# Altium schematic sheet NETWORK_RS485.SchDoc
size A4; SheetNumber: 3; SheetTotal: 6
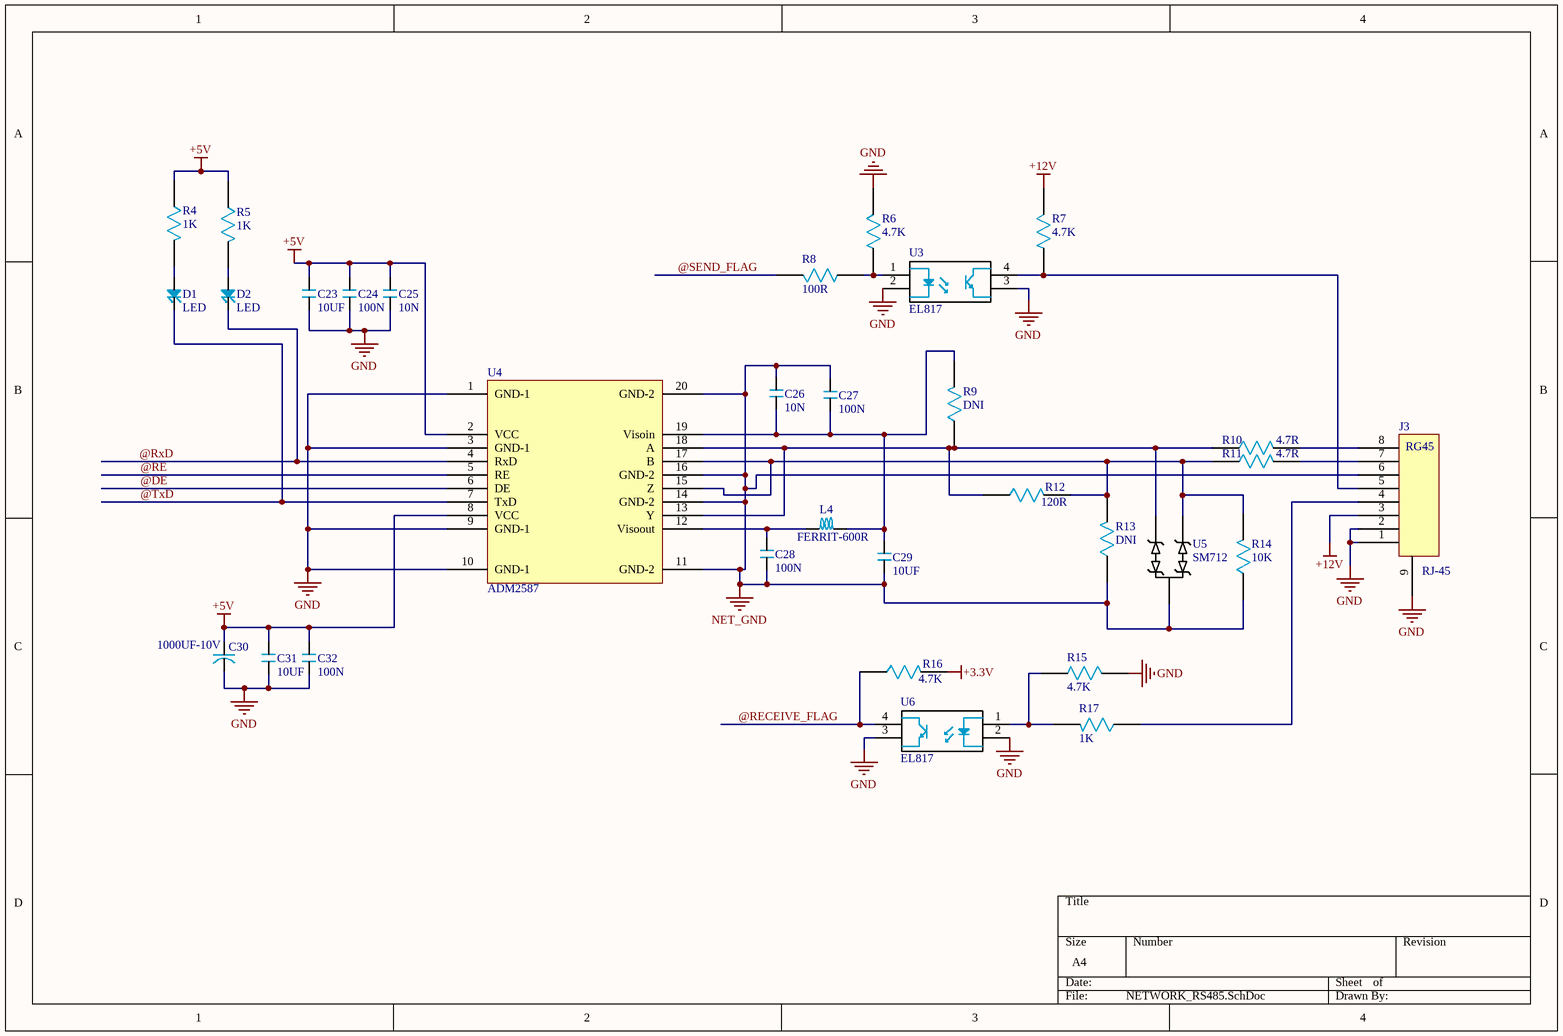
[diagram p0: NETWORK_RS485.SchDoc]

## Parts
C23  10UF  [0603]
C24  100N  [0603]
C25  10N  [0603]
C26  10N  [1206]
C27  100N  [1206]
C28  100N  [1206]
C29  10UF  [1206]
C30  1000UF-10V  [RB.2/.4]
C31  10UF  [0603]
C32  100N  [0603]
D1  LED  [0603]
D2  LED  [0603]
J3  RJ-45  [RJ-45]
L4  FERRIT-600R  [1206]
R4  1K  [0603]
R5  1K  [0603]
R6  4.7K  [1206]
R7  4.7K  [1206]
R8  100R  [1206]
R9  DNI  [1206]
R10  4.7R  [1206]
R11  4.7R  [1206]
R12  120R  [1206]
R13  DNI  [1206]
R14  10K  [1206]
R15  4.7K  [1206]
R16  4.7K  [1206]
R17  1K  [1206]
U3  EL817  [DIP4]
U4  ADM2587  [SOIC20_W]
U5  SM712  [SOT-23]
U6  EL817  [DIP4]

## Nets
+3.3V: R16.2
+5V: C23.2 C24.2 C25.1 C30.1 C31.2 C32.2 R4.1 R5.1 U4.2(VCC) U4.8(VCC)
+12V: J3.3 R7.1
GND: C23.1 C24.1 C25.2 C30.2 C31.1 C32.1 J3.1 J3.2 J3.9 R6.1 R15.1 U3.2 U3.3 U4.1(GND-1) U4.3(GND-1) U4.9(GND-1) U4.10(GND-1) U6.2 U6.3
NET_GND: C26.1 C27.2 C28.2 C29.1 J3.6 R13.1 R14.1 U4.11(GND-2) U4.14(GND-2) U4.16(GND-2) U4.20(GND-2) U5.3
@DE: U4.6(DE)
@RE: U4.5(RE)
@RECEIVE_FLAG: R16.1 U6.4
@RxD: D2.2 U4.4(RxD)
@SEND_FLAG: R8.1
@TxD: D1.2 U4.7(TxD)
NetC26_2: C26.2 C27.1 C29.2 L4.2 R9.2 U4.19(Visoin)
NetC28_1: C28.1 L4.1 U4.12(Visoout)
NetD1_1: D1.1 R4.2
NetD2_1: D2.1 R5.2
NetJ3_4: J3.4 R17.1
NetJ3_5: J3.5 R7.2 U3.4
NetJ3_7: J3.7 R11.2
NetJ3_8: J3.8 R10.2
NetR6_2: R6.2 R8.2 U3.1
NetR9_1: R9.1 R10.1 R12.1 U4.13(Y) U4.18(A) U5.1
NetR11_1: R11.1 R12.2 R13.2 R14.2 U4.15(Z) U4.17(B) U5.2
NetR15_2: R15.2 R17.2 U6.1

## Notes on the sheet
- (in symbol RJ-45) RG45

## Library data of the parts
C23-C29 C31 C32 = CAP
C30 = CAP_POL
L4 = SELF
R4-R17 = RES
U3 U6 = TLP521
U4 = AMD2582